# Altium schematic sheet control.SchDoc
size A4
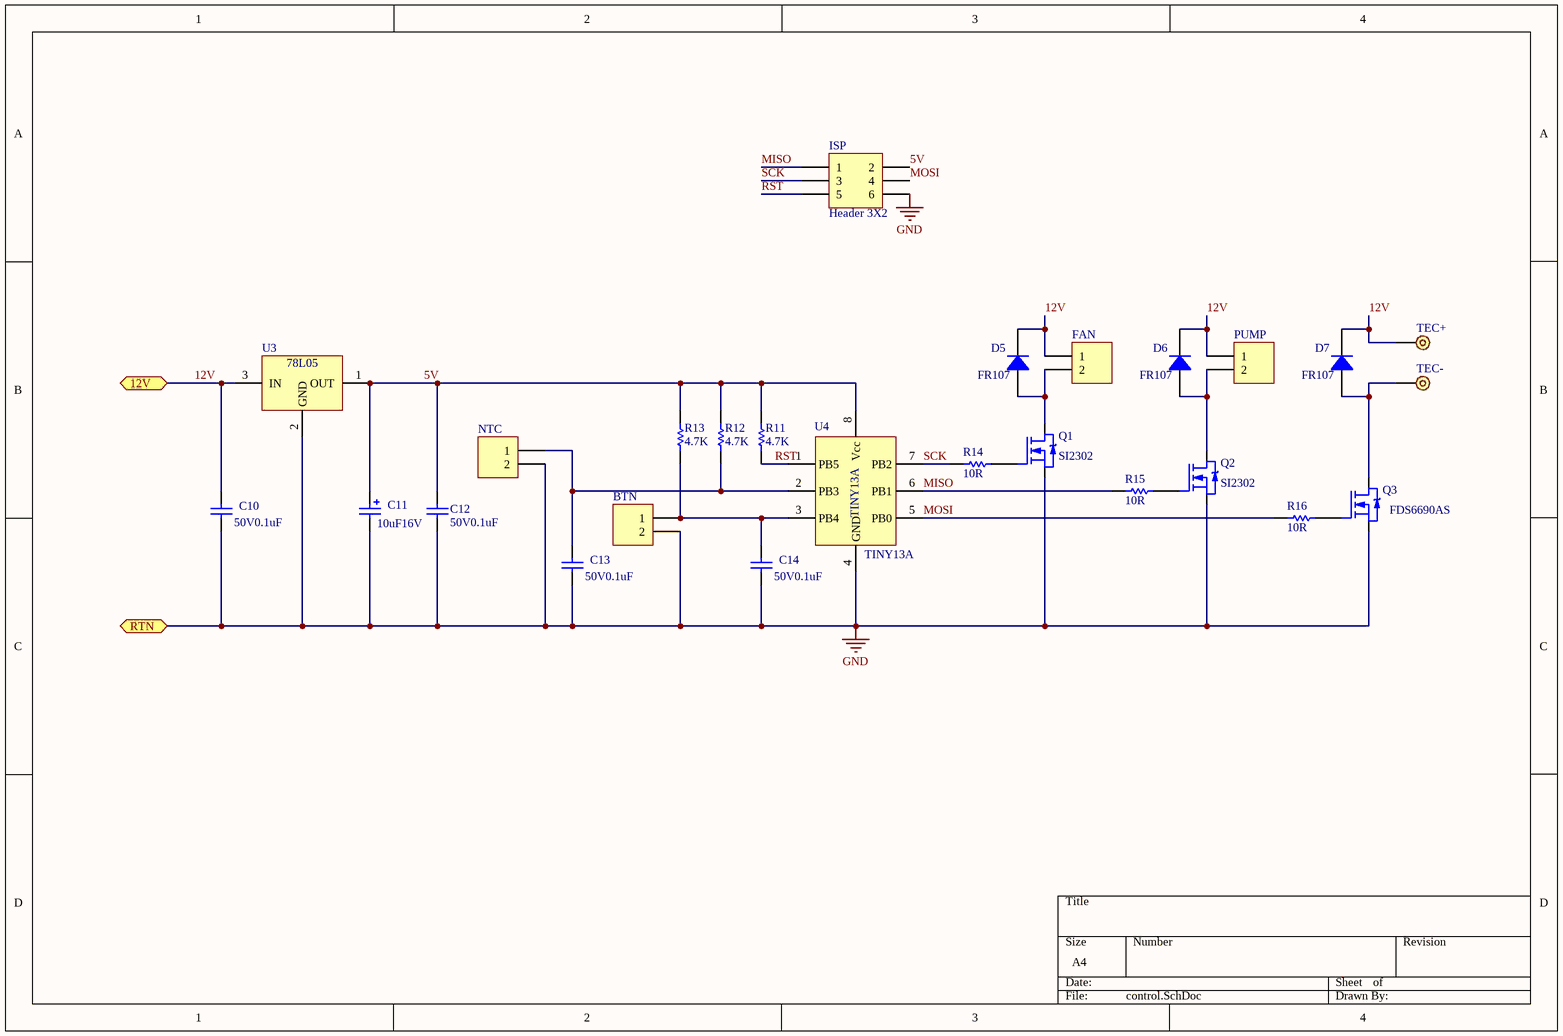
[diagram p0: control.SchDoc]

## Parts
BTN  (no value)  [JST2]
C10  50V0.1uF  [CAP0805]
C11  10uF16V  [CAP1206]
C12  50V0.1uF  [CAP0805]
C13  50V0.1uF  [CAP0805]
C14  50V0.1uF  [CAP0805]
D5  FR107  [DO214AC]
D6  FR107  [DO214AC]
D7  FR107  [DO214AC]
FAN  (no value)  [JST2]
ISP  Header 3X2  [HDR2X3]
NTC  (no value)  [JST2]
PUMP  (no value)  [JST2]
Q1  SI2302  [SOT23_NMOS]
Q2  SI2302  [SOT23_NMOS]
Q3  FDS6690AS  [SO8-NMOS]
R11  4.7K  [RES0805]
R12  4.7K  [RES0805]
R13  4.7K  [RES0805]
R14  10R  [RES0805]
R15  10R  [RES0805]
R16  10R  [RES0805]
TEC+  (no value)  [PAD1]
TEC-  (no value)  [PAD1]
U3  (no value)  [SOT89_VREG]
U4  TINY13A  [SO8]

## Ports
12V, RTN

## Nets
GND: BTN.2 C10.2 C11.2 C12.2 C13.2 C14.2 ISP.6 NTC.2 Q1.S Q2.S Q3.S U3.2(GND) U4.4(GND) ; port RTN
5V: C11.1 C12.1 ISP.2 R11.2 R12.2 R13.2 U3.1(OUT) U4.8(Vcc)
12V: C10.1 D5.2(K) D6.2(K) D7.2(K) FAN.1 PUMP.1 TEC+.1 U3.3(IN) ; port 12V
MISO: ISP.1 R15.2 U4.6(PB1)
MOSI: ISP.4 R16.2 U4.5(PB0)
RST: ISP.5 R11.1 U4.1(PB5)
SCK: ISP.3 R14.2 U4.7(PB2)
NetBTN_1: BTN.1 C14.1 R13.1 U4.3(PB4)
NetC13_1: C13.1 NTC.1 R12.1 U4.2(PB3)
NetD5_1: D5.1(A) FAN.2 Q1.D
NetD6_1: D6.1(A) PUMP.2 Q2.D
NetD7_1: D7.1(A) Q3.D TEC-.1
NetQ1_G: Q1.G R14.1
NetQ2_G: Q2.G R15.1
NetQ3_G: Q3.G R16.1

## Library data of the parts
BTN FAN NTC PUMP = Header 2: Header, 2-Pin; LatestRevisionDate: 17-Jul-2002; LatestRevisionNote: Re-released for DXP Platform.; Publisher: Altium Limited
C10 C12-C14 = Cap: Capacitor; Published: 8-Jun-2000; LatestRevisionDate: 17-Jul-2002; LatestRevisionNote: Re-released for DXP Platform.; Publisher: Altium Limited
C11 = Cap Pol2: Polarized Capacitor (Axial); Published: 8-Jun-2000; LatestRevisionDate: 17-Jul-2002; LatestRevisionNote: Re-released for DXP Platform.; Publisher: Altium Limited
D5-D7 = Diode: 1 Amp Fast Recovery Rectifier; Published: 8-Jun-2000; LatestRevisionDate: 17-Jul-2002; LatestRevisionNote: Re-released for DXP Platform.; PackageReference: DO-41; Publisher: Altium Limited; Code_JEDEC: DO-204-AL; DatasheetDocument: 1999; PackageDocument: Aug-1999; ComponentLink1Description: Manufacturer Link; ComponentLink1URL: http://www.fairchildsemi.com/
ISP = Header 3X2: Header, 3-Pin, Dual row; LatestRevisionDate: 17-Jul-2002; LatestRevisionNote: Re-released for DXP Platform.; Publisher: Altium Limited
Q1-Q3 = NMOS: DUAL MOSFET N; Published: 8-Jun-2000; LatestRevisionDate: 17-Jul-2002; LatestRevisionNote: Re-released for DXP Platform.; PackageVersion: 1995/1996; PackageReference: E3; Publisher: Altium Limited; PackageDescription: TO, Flat Index; 3 In-Line, Axial Leads; Body Dia. 4.6mm; Lead Dia. 0.5 mm (max)
R11-R16 = Res1: Resistor; Published: 8-Jun-2000; LatestRevisionDate: 17-Jul-2002; LatestRevisionNote: Re-released for DXP Platform.; Publisher: Altium Limited
TEC+ TEC- = Header1: Header, 1-Pin; LatestRevisionDate: 17-Jul-2002; LatestRevisionNote: Re-released for DXP Platform.; Publisher: Altium Limited
U3 = 78L05: Positive Voltage Regulator; Published: 24-Aug-2001; LatestRevisionDate: 6-Jun-2005; LatestRevisionNote: PCB pads lengthened.; DatasheetDocument: Apr-1994; PackageDocument: Jun-2004; PackageReference: TO-252; Publisher: Altium Limited; ComponentLink1Description: Manufacturer Link; ComponentLink1URL: http://www.st.com/
U4 = TINY13A: AVR MCU